# EAGLE design jlpcb-128 (EAGLE 5.11)
ABBREV: jn6; PROJECT: JeeNode v6
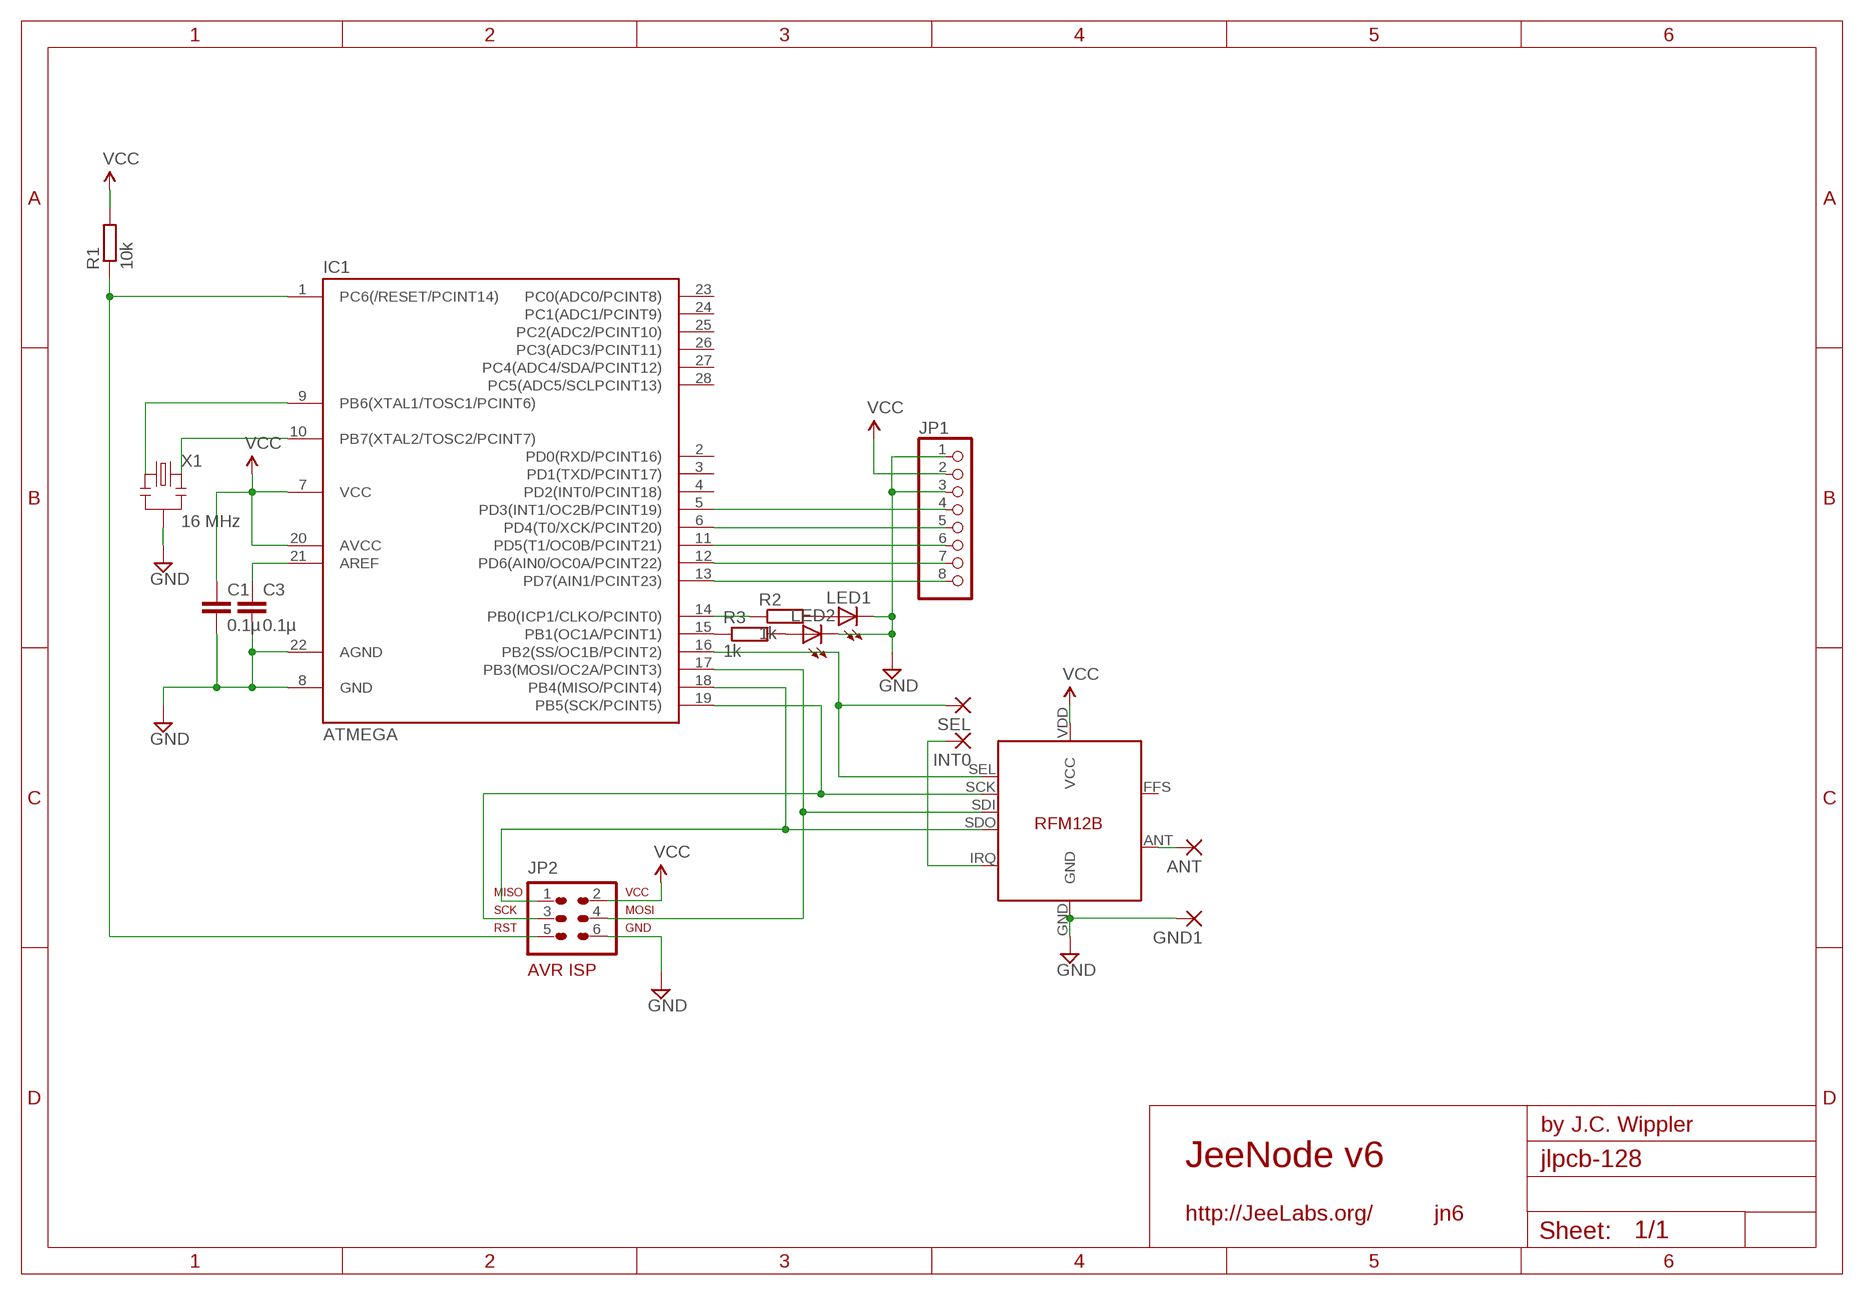
[diagram p0: schematic, sheet 1]

## Parts
ANT  1,6/0,8  [1,6/0,8]
C1  0.1µ  C-EU025-024X044  [C025-024X044]
C3  0.1µ  C-EU025-024X044  [C025-024X044]
GND1  1,6/0,8  [1,6/0,8]
IC1  ATMEGA  ATMEGA48/88/168-PU  [DIL28-3]
INT0  1,6/0,8  [1,6/0,8]
JP1  PINHD-1X8/90  [1X08/90]
JP2  AVR-ISP-6HORZ  [AVR-ISP-6R]
LED1  LED3MM  [LED3MM]
LED2  LED3MM  [LED3MM]
R1  10k  R-EU_0204/7  [0204/7]
R2  1k  R-EU_0204/7  [0204/7]
R3  1k  R-EU_0204/7  [0204/7]
SEL  1,6/0,8  [1,6/0,8]
U$1  RFM12B  [RFM12B]
X1  16 MHz  RESONATORPTH  [RESONATOR-PTH]

## Nets
GND [power]: C1.2 C3.2 GND1.1(P) IC1.8(GND) IC1.22(AGND) JP1.1 JP1.3 JP2.6 LED1.K(C) LED2.K(C) U$1.GND X1.2
N$1: IC1.9(PB6(XTAL1/TOSC1/PCINT6)) X1.1
N$3: IC1.17(PB3(MOSI/OC2A/PCINT3)) JP2.4 U$1.SDI
N$4: IC1.16(PB2(SS/OC1B/PCINT2)) SEL.1(P) U$1.SEL
N$5: IC1.19(PB5(SCK/PCINT5)) JP2.3 U$1.SCK
N$6: IC1.14(PB0(ICP1/CLKO/PCINT0)) R2.1
N$7: INT0.1(P) U$1.IRQ
N$8: IC1.13(PD7(AIN1/PCINT23)) JP1.8
N$9: IC1.12(PD6(AIN0/OC0A/PCINT22)) JP1.7
N$10: IC1.11(PD5(T1/OC0B/PCINT21)) JP1.6
N$11: IC1.6(PD4(T0/XCK/PCINT20)) JP1.5
N$12: IC1.5(PD3(INT1/OC2B/PCINT19)) JP1.4
N$13: ANT.1(P) U$1.ANT
N$14: IC1.15(PB1(OC1A/PCINT1)) R3.1
N$15: LED1.A R2.2
N$16: LED2.A R3.2
N$18: IC1.18(PB4(MISO/PCINT4)) JP2.1 U$1.SDO
N$19: C3.1 IC1.21(AREF)
N$21: IC1.10(PB7(XTAL2/TOSC2/PCINT7)) X1.3
RST: IC1.1(PC6(/RESET/PCINT14)) JP2.5 R1.1
VCC [power]: C1.1 IC1.7(VCC) IC1.20(AVCC) JP1.2 JP2.2 R1.2 U$1.VDD(VCC)
Unconnected: IC1.2(PD0(RXD/PCINT16)) IC1.3(PD1(TXD/PCINT17)) IC1.4(PD2(INT0/PCINT18)) IC1.23(PC0(ADC0/PCINT8)) IC1.24(PC1(ADC1/PCINT9)) IC1.25(PC2(ADC2/PCINT10)) IC1.26(PC3(ADC3/PCINT11)) IC1.27(PC4(ADC4/SDA/PCINT12)) IC1.28(PC5(ADC5/SCLPCINT13)) U$1.FFS

## Library data of the parts
ANT GND1 INT0 SEL = JeeLabs:1,6/0,8: THROUGH-HOLE PAD
C1 C3 = resistor:C-EU: CAPACITOR, European symbol
IC1 = atmega8:ATMEGA48/88/168-PU
JP1 = pinhead:PINHD-1X8: PIN HEADER
JP2 = avr-7:AVR-ISP-6: AVR ISP-6 Serial Programming Header
LED1 LED2 = led:LED: LED OSRAM: - CHIPLED LG R971, LG N971, LY N971, LG Q971, LY Q971, LO R971, LY R971 LH N974, LH R974 LS Q976, LO Q976, LY Q976 LO Q996 - Hyper CHIPLED LW Q18S LB Q993, LB Q99A, LB R99A - SideLED LS A670, LO A670, LY A670, LG A670, LP A670 LB A673, LV A673, LT A673, LW A673 LH A674 LY A675 LS A676, LA A676, LO A676, LY A676, LW A676 LS A679, LY A679, LG A679 - Hyper Micro SIDELED® LS Y876, LA Y876, LO Y876, LY Y876 LT Y87S - SmartLED LW L88C, LW L88S LB L89C, LB L89S, LG L890 LS L89K, LO L89K, LY L89K LS L896, LA L896, LO L896, LY L896 - TOPLED LS T670, LO T670, LY T670, LG T670, LP T670 LSG T670, LSP T670, LSY T670, LOP T670, LYG T670 LG T671, LOG T671, LSG T671 LB T673, LV T673, LT T673, LW T673 LH T674 LS T676, LA T676, LO T676, LY T676, LB T676, LH T676, LSB T676, LW T676 LB T67C, LV T67C, LT T67C, LS T67K, LO T67K, LY T67K, LW E67C LS E67B, LA E67B, LO E67B, LY E67B, LB E67C, LV E67C, LT E67C LW T67C LS T679, LY T679, LG T679 LS T770, LO T770, LY T770, LG T770, LP T770 LB T773, LV T773, LT T773, LW T773 LH T774 LS E675, LA E675, LY E675, LS T675 LS T776, LA T776, LO T776, LY T776, LB T776 LHGB T686 LT T68C, LB T68C - Hyper Mini TOPLED® LB M676 - Mini TOPLED Santana® LG M470 LS M47K, LO M47K, LY M47K Source: http://www.osram.convergy.de LUXEON: - LUMILED® LXK2-PW12-R00, LXK2-PW12-S00, LXK2-PW14-U00, LXK2-PW14-V00 LXK2-PM12-R00, LXK2-PM12-S00, LXK2-PM14-U00 LXK2-PE12-Q00, LXK2-PE12-R00, LXK2-PE12-S00, LXK2-PE14-T00, LXK2-PE14-U00 LXK2-PB12-K00, LXK2-PB12-L00, LXK2-PB12-M00, LXK2-PB14-N00, LXK2-PB14-P00, LXK2-PB14-Q00 LXK2-PR12-L00, LXK2-PR12-M00, LXK2-PR14-Q00, LXK2-PR14-R00 LXK2-PD12-Q00, LXK2-PD12-R00, LXK2-PD12-S00 LXK2-PH12-R00, LXK2-PH12-S00 LXK2-PL12-P00, LXK2-PL12-Q00, LXK2-PL12-R00 Source: www.luxeon.com KINGBRIGHT: KA-3528ASYC Source: www.kingbright.com
R1 = resistor:R-EU_: RESISTOR, European symbol
R2 R3 = rcl:R-EU_: RESISTOR, European symbol
U$1 = JeeLabs:RFM12B
X1 = SparkFun:RESONATOR: Resonator Small SMD resonator. This is the itty bitty 10/20MHz resonators with built in caps. CSTCE10M0G55 and CSTCE20M0V53. Footprint has been reviewed closely but hasn't been tested yet.

## Net classes
1 power: width 0.381 mm, clearance 0.254 mm

## Board
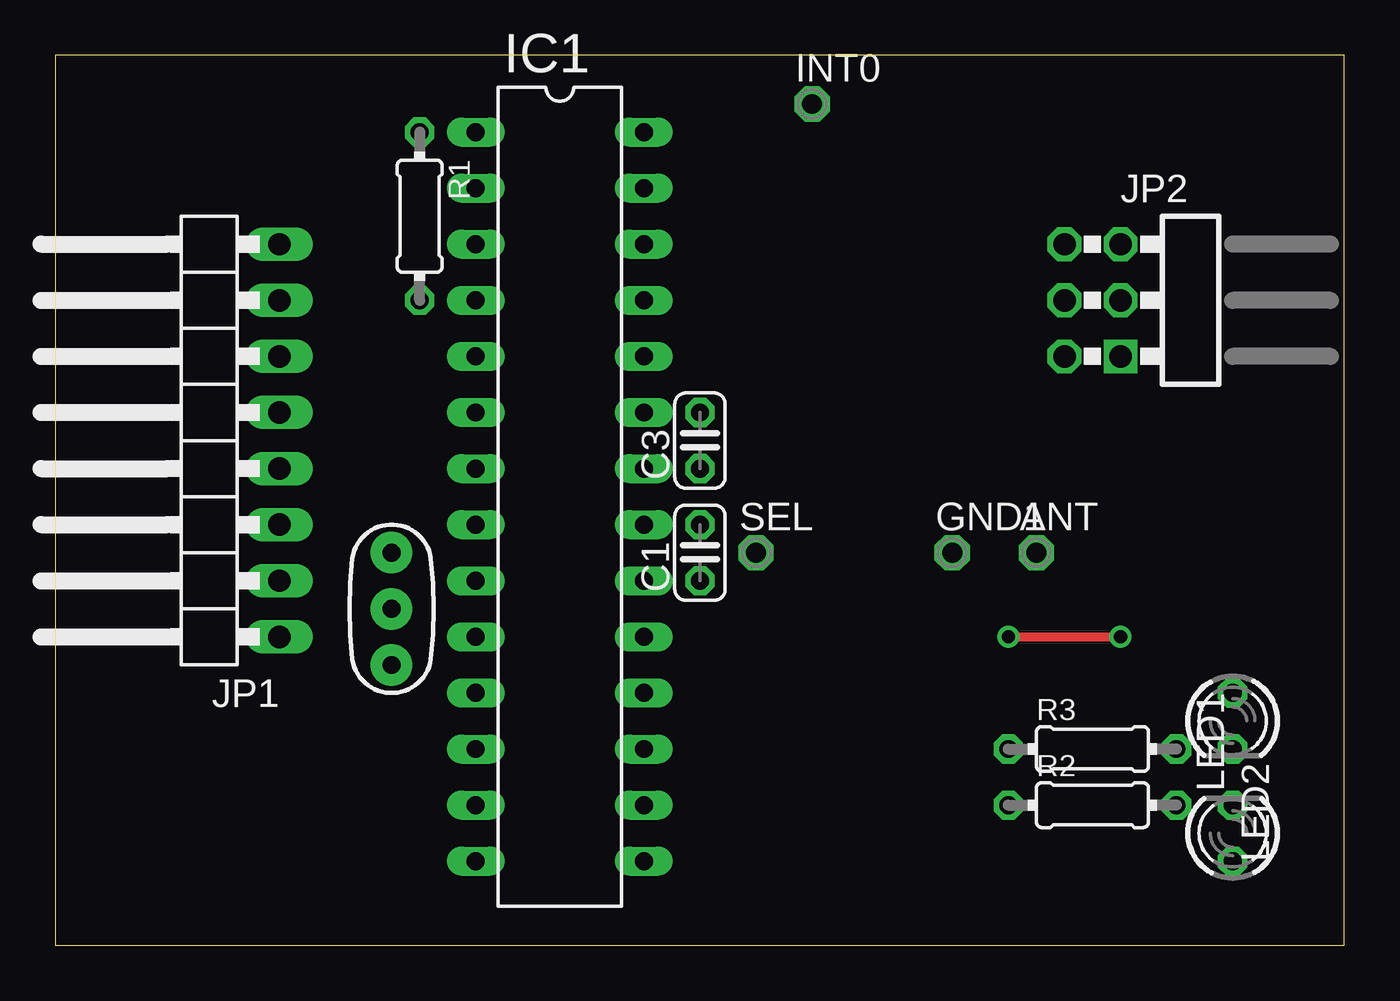
[diagram p1: board, top side]
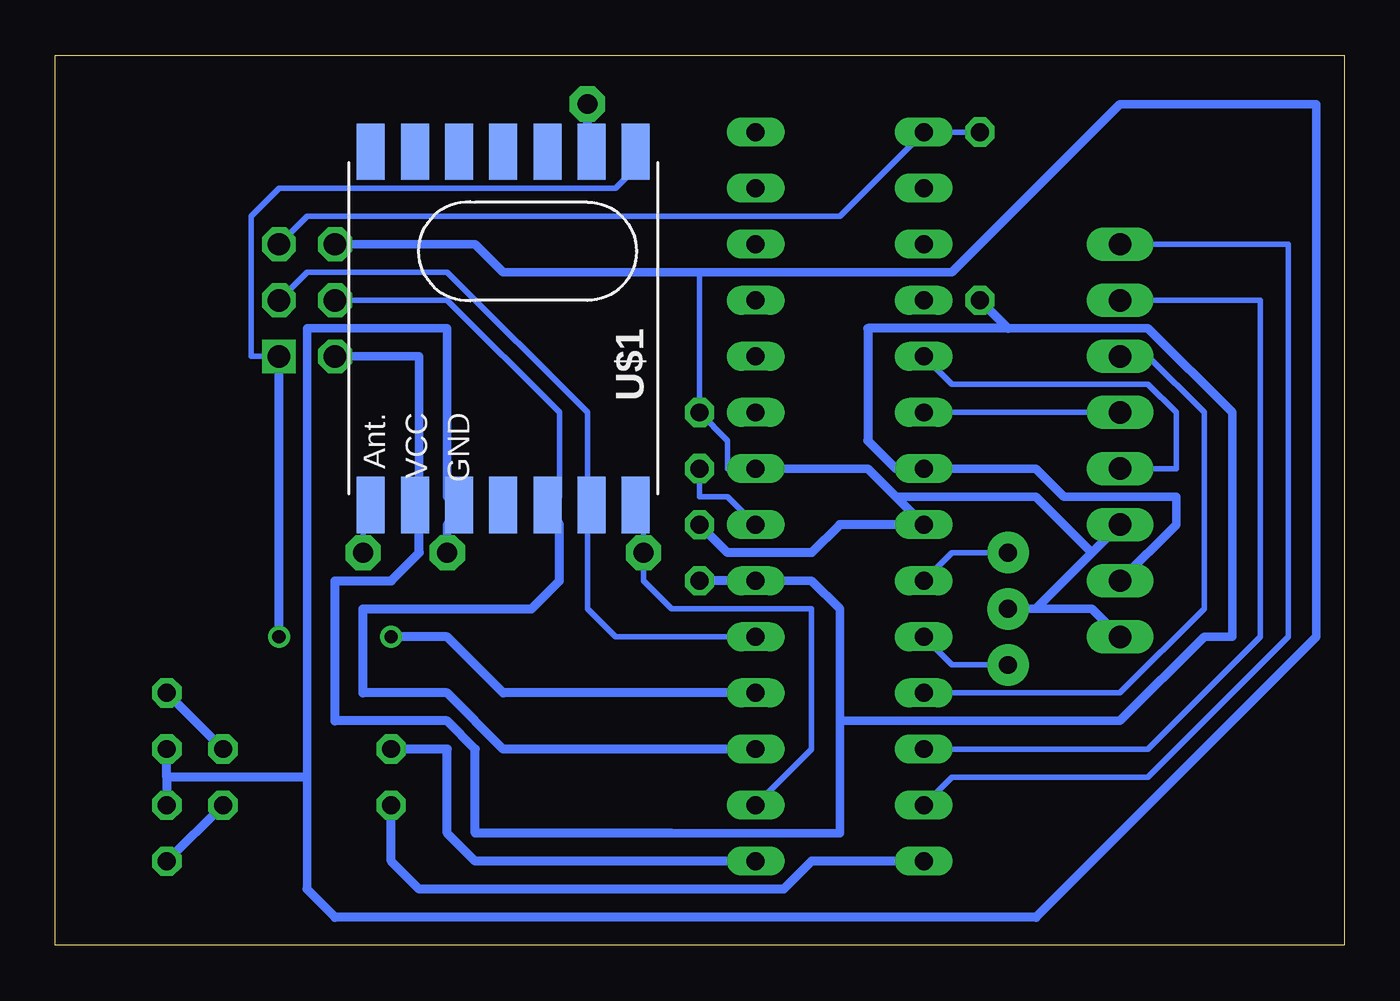
[diagram p2: board, bottom side, seen from below]

Size 58.4 x 40.31 mm. Coordinates in mm from the lower left corner, seen from the top.
Outline: 0,0 58.4,0 58.4,40.31 0,40.31 0,0
Copper layers (1*16): Top 0.035mm / dielectric 1.5mm / Bottom 0.035mm
Design rules "default": minimum track width 10mil, minimum drill 24mil, track to track 8mil, track to pad 8mil, pad to pad 8mil, via to via 8mil, smd to smd 8mil, copper to edge 40mil, drill to drill 8mil, minimum pad ring 10mil, minimum via ring 8mil, stop-mask expansion 4mil, vias tented up to drill 0mil, thermal gap 10mil

### Footprints (pad centres in the part's own frame; a part is rotated, then mirrored left to right if it is on the bottom)
1,6/0,8 = drill 0.9 pad 1.6 octagon: 1 0,0
C025-024X044 = drill 0.813 octagon: 1 -1.27,0; 2 1.27,0
DIL28-3 = drill 0.813 long: 1 -16.51,-3.81; 2 -13.97,-3.81; 3 -11.43,-3.81; 4 -8.89,-3.81; 5 -6.35,-3.81; 6 -3.81,-3.81; 7 -1.27,-3.81; 8 1.27,-3.81; 9 3.81,-3.81; 10 6.35,-3.81; 11 8.89,-3.81; 12 11.43,-3.81; 13 13.97,-3.81; 14 16.51,-3.81; 15 16.51,3.81; 16 13.97,3.81; 17 11.43,3.81; 18 8.89,3.81; 19 6.35,3.81; 20 3.81,3.81; 21 1.27,3.81; 22 -1.27,3.81; 23 -3.81,3.81; 24 -6.35,3.81; 25 -8.89,3.81; 26 -11.43,3.81; 27 -13.97,3.81; 28 -16.51,3.81
1X08/90 = drill 1.016 long: 1 -8.89,-3.81; 2 -6.35,-3.81; 3 -3.81,-3.81; 4 -1.27,-3.81; 5 1.27,-3.81; 6 3.81,-3.81; 7 6.35,-3.81; 8 8.89,-3.81
AVR-ISP-6R = drill 1.016 square: 1 -2.54,-1.27 | drill 1.016 octagon: 2 -2.54,1.27; 3 0,-1.27; 4 0,1.27; 5 2.54,-1.27; 6 2.54,1.27
LED3MM = drill 0.813 octagon: A -1.27,0; K 1.27,0
0204/7 = drill 0.813 octagon: 1 -3.81,0; 2 3.81,0
RFM12B = smd 2.54 x 1.27: ANT 8,-6; FFS -8,2; GND 8,-2; IRQ -8,4; P$8 -8,0; P$9 -8,-2; P$10 -8,-4; P$12 -8,-6; P$16 8,0; SCK 8,4; SDI 8,2; SDO -8,6; SEL 8,6; VDD 8,-4
RESONATOR-PTH = drill 0.8 pad 1.88 round: 1 -2.54,0; 2 0,0; 3 2.54,0

### Placement (x,y rotation side)
ANT  44.45,17.78 0 top
C1  29.21,17.78 90 top
C3  29.21,22.86 90 top
GND1  40.64,17.78 0 top
IC1  22.86,20.32 270 top
INT0  34.29,38.1 0 top
JP1  6.35,22.86 90 top
JP2  46.99,29.21 90 top
LED1  53.34,5.08 90 top
LED2  53.34,10.16 270 top
R1  16.51,33.02 270 top
R2  46.99,6.35 0 top
R3  46.99,8.89 0 top
SEL  31.75,17.78 0 top
U$1  38.1,27.94 270 bottom
X1  15.24,15.24 270 top

### Tracks (layer width: path | path; a pad name or v marks a point on that pad's centre or on a via)
GND
  Bottom 0.254: IC1.22 27.94,21.59 27.94,22.86 C3.2 29.21,30.48
  Bottom 0.381: JP1.1 11.43,15.24 13.97,15.24 | 13.97,15.24 X1.2 | 11.43,17.78 13.97,15.24 | 11.43,17.78 JP1.3 | GND1.1 40.64,19.05 U$1.GND 40.64,20.32 40.64,27.94 46.99,27.94 46.99,7.62 46.99,2.54 | 20.32,20.32 21.59,21.59 IC1.22 | 20.32,20.32 IC1.8 | JP2.6 39.37,31.75 38.1,30.48 29.21,30.48 17.78,30.48 10.16,38.1 1.27,38.1 1.27,13.97 12.7,2.54 | 11.43,17.78 13.97,20.32 20.32,20.32
  Bottom 0.406: 53.34,7.62 LED1.K | 53.34,7.62 LED2.K | 12.7,2.54 13.97,1.27 45.72,1.27 46.99,2.54 | 46.99,7.62 53.34,7.62 | C1.2 27.94,17.78 24.13,17.78 22.86,19.05 IC1.8
N$1
  Bottom 0.254: IC1.9 17.78,17.78 X1.1
N$3
  Bottom 0.254: JP2.4 40.64,29.21 35.56,24.13 35.56,20.32 U$1.SDI
  Bottom 0.406: IC1.17 38.1,8.89 40.64,11.43 44.45,11.43 44.45,15.24 36.83,15.24 35.56,16.51 35.56,19.05 U$1.SDI
N$4
  Bottom 0.254: IC1.16 24.13,8.89 24.13,15.24 30.48,15.24 31.75,16.51 SEL.1 31.75,19.05 U$1.SEL
N$5
  Bottom 0.254: JP2.3 46.99,30.48 40.64,30.48 34.29,24.13 34.29,20.32 U$1.SCK 34.29,19.05 34.29,15.24 33.02,13.97 IC1.19
N$6
  Bottom 0.406: IC1.14 24.13,3.81 25.4,2.54 41.91,2.54 43.18,3.81 R2.1
N$7
  Bottom 0.406: INT0.1 34.29,36.83 U$1.IRQ
N$8
  Bottom 0.254: IC1.13 17.78,7.62 8.89,7.62 2.54,13.97 2.54,31.75 JP1.8
N$9
  Bottom 0.254: IC1.12 8.89,8.89 3.81,13.97 3.81,29.21 JP1.7
N$10
  Bottom 0.254: IC1.11 10.16,11.43 6.35,15.24 6.35,24.13 8.89,26.67 JP1.6
N$11
  Bottom 0.254: JP1.5 IC1.6
N$12
  Bottom 0.254: IC1.5 17.78,25.4 8.89,25.4 7.62,24.13 7.62,21.59 JP1.4
N$13
  Bottom 0.254: ANT.1 44.45,19.05 U$1.ANT
N$14
  Bottom 0.406: IC1.15 39.37,3.81 40.64,5.08 40.64,8.89 R3.1
N$15
  Bottom 0.406: LED1.A R2.2
N$16
  Bottom 0.406: R3.2 LED2.A
N$18  (via drill 0.6)
  Top 0.406: v43.18,13.97 v48.26,13.97
  Bottom 0.254: JP2.1 49.53,26.67 49.53,33.02 48.26,34.29 33.02,34.29 31.75,35.56 U$1.SDO
  Bottom 0.406: IC1.18 38.1,11.43 40.64,13.97 v43.18,13.97 | v48.26,13.97 JP2.1
N$19
  Bottom 0.254: IC1.21 27.94,20.32 29.21,20.32 C3.1
N$21
  Bottom 0.254: IC1.10 17.78,12.7 X1.3
RST
  Bottom 0.254: R1.1 IC1.1 22.86,33.02 46.99,33.02 JP2.5
VCC
  Bottom 0.381: JP1.2 7.62,19.05 7.62,20.32 12.7,20.32 13.97,21.59 IC1.7 | JP2.2 41.91,26.67 41.91,20.32 U$1.VDD | IC1.20 24.13,16.51 22.86,15.24 22.86,10.16 | 22.86,10.16 22.86,5.08 30.48,5.08 | 22.86,10.16 10.16,10.16 6.35,13.97 5.08,13.97 5.08,24.13 8.89,27.94 15.24,27.94 R1.2
  Bottom 0.406: IC1.7 20.32,21.59 21.59,22.86 21.59,27.94 15.24,27.94 | 30.48,5.08 39.37,5.08 39.37,8.89 40.64,10.16 45.72,10.16 45.72,16.51 43.18,16.51 41.91,17.78 41.91,19.05 U$1.VDD | IC1.20 C1.1